# Altium schematic sheet Main.SchDoc
size A4
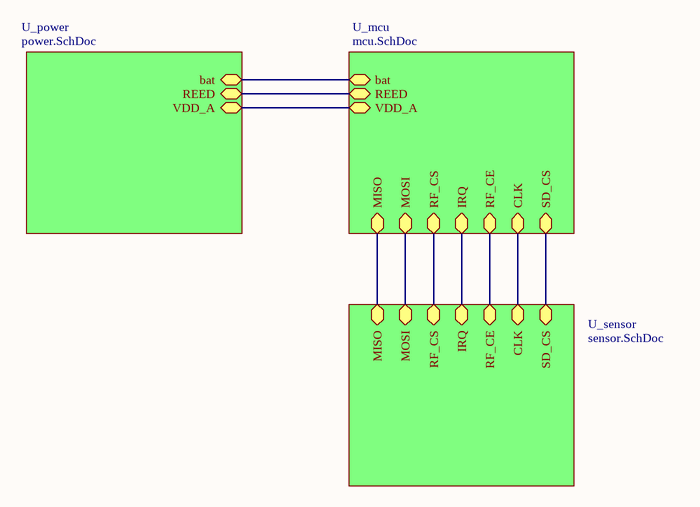
[diagram p0: Main.SchDoc]

## Sub-sheets
U_mcu = mcu.SchDoc: bat, MISO, MOSI, RF_CS, IRQ, RF_CE, CLK, SD_CS, REED, VDD_A
U_power = power.SchDoc: bat, REED, VDD_A
U_sensor = sensor.SchDoc: MISO, MOSI, RF_CS, IRQ, RF_CE, CLK, SD_CS

## Nets
(unnamed): sheet U_power/bat, sheet U_mcu/bat
(unnamed): sheet U_power/REED, sheet U_mcu/REED
(unnamed): sheet U_power/VDD_A, sheet U_mcu/VDD_A
(unnamed): sheet U_mcu/MISO, sheet U_sensor/MISO
(unnamed): sheet U_mcu/MOSI, sheet U_sensor/MOSI
(unnamed): sheet U_mcu/RF_CS, sheet U_sensor/RF_CS
(unnamed): sheet U_mcu/IRQ, sheet U_sensor/IRQ
(unnamed): sheet U_mcu/RF_CE, sheet U_sensor/RF_CE
(unnamed): sheet U_mcu/CLK, sheet U_sensor/CLK
(unnamed): sheet U_mcu/SD_CS, sheet U_sensor/SD_CS